# EAGLE design led_lamp (EAGLE 7.7.0)
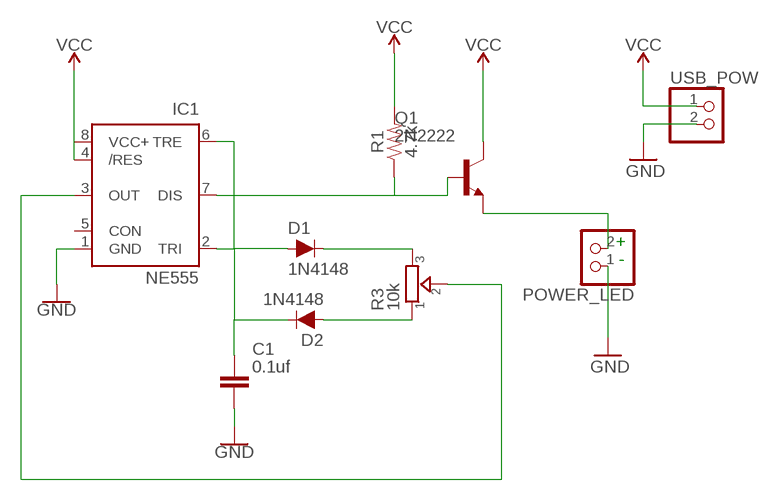
[diagram p0: schematic, sheet 1]

## Parts
C1  0.1uf  CAPACITOR_NPOL-PTH_0.1"  [C0.1PTH]
D1  1N4148  DIODE-1N4148  [DIODE-1N4148]
D2  1N4148  DIODE-1N4148  [DIODE-1N4148]
IC1  NE555  [DIL-08]
POWER_LED  PINHD-1X2  [1X02]
Q1  2N2222  2N2222-NPN-TO92-EBC  [TO92-EBC]
R1  4.7k  10OHM-HORIZ_KIT-1/4W-1%  [AXIAL-0.3-KIT]
R3  10k  TRIMMER-3306F  [TRIMMER_3306F]
USB_POW  PINHD-1X2  [1X02]

## Nets
GND: C1.2 IC1.1(GND) POWER_LED.1 USB_POW.2
N$1: IC1.7(DIS) Q1.B R1.P$1
N$2: C1.1 D1.A D2.C IC1.2(TRI) IC1.6(TRE)
N$3: D1.C R3.3
N$4: D2.A R3.1
N$5: IC1.3(OUT) R3.2
N$7: POWER_LED.2 Q1.E
VCC: IC1.4(/RES) IC1.8(VCC+) Q1.C R1.P$2 USB_POW.1
Unconnected: IC1.5(CON)

## Notes on the sheet
- +
- -

## Library data of the parts
C1 = dp_devices.v6:CAPACITOR_NPOL: Non-Polarized capacitor in various packages
D1 D2 = SparkFun-DiscreteSemi:DIODE: Diode These are standard reverse protection diodes and small signal diodes. SparkFun Products: SparkFun SparkPunk Sound Kit <https://www.sparkfun.com/products/11177> SparkFun ESP8266 Thing <https://www.sparkfun.com/products/13231>; PROD_ID: DIO-08378; VALUE: 200mA/100V/1V
IC1 = st-microelectronics:NE555: General purpose bipolar Timer; MF: Arrow Electronics; MPN: NE555N; OC_FARNELL: 1467742; OC_NEWARK: 89K1486
POWER_LED USB_POW = pinhead:PINHD-1X2: PIN HEADER
Q1 = transistor-neu-to92:*-NPN-: NPN Transistror
R1 = SparkFun-Resistors:10OHM: 10Ω resistor A resistor is a passive two-terminal electrical component that implements electrical resistance as a circuit element. Resistors act to reduce current flow, and, at the same time, act to lower voltage levels within circuits. - Wikipedia; PROD_ID: RES-12180; VALUE: 10
R3 = dp_devices.v6:TRIMMER: Trimmer resistor

## Board
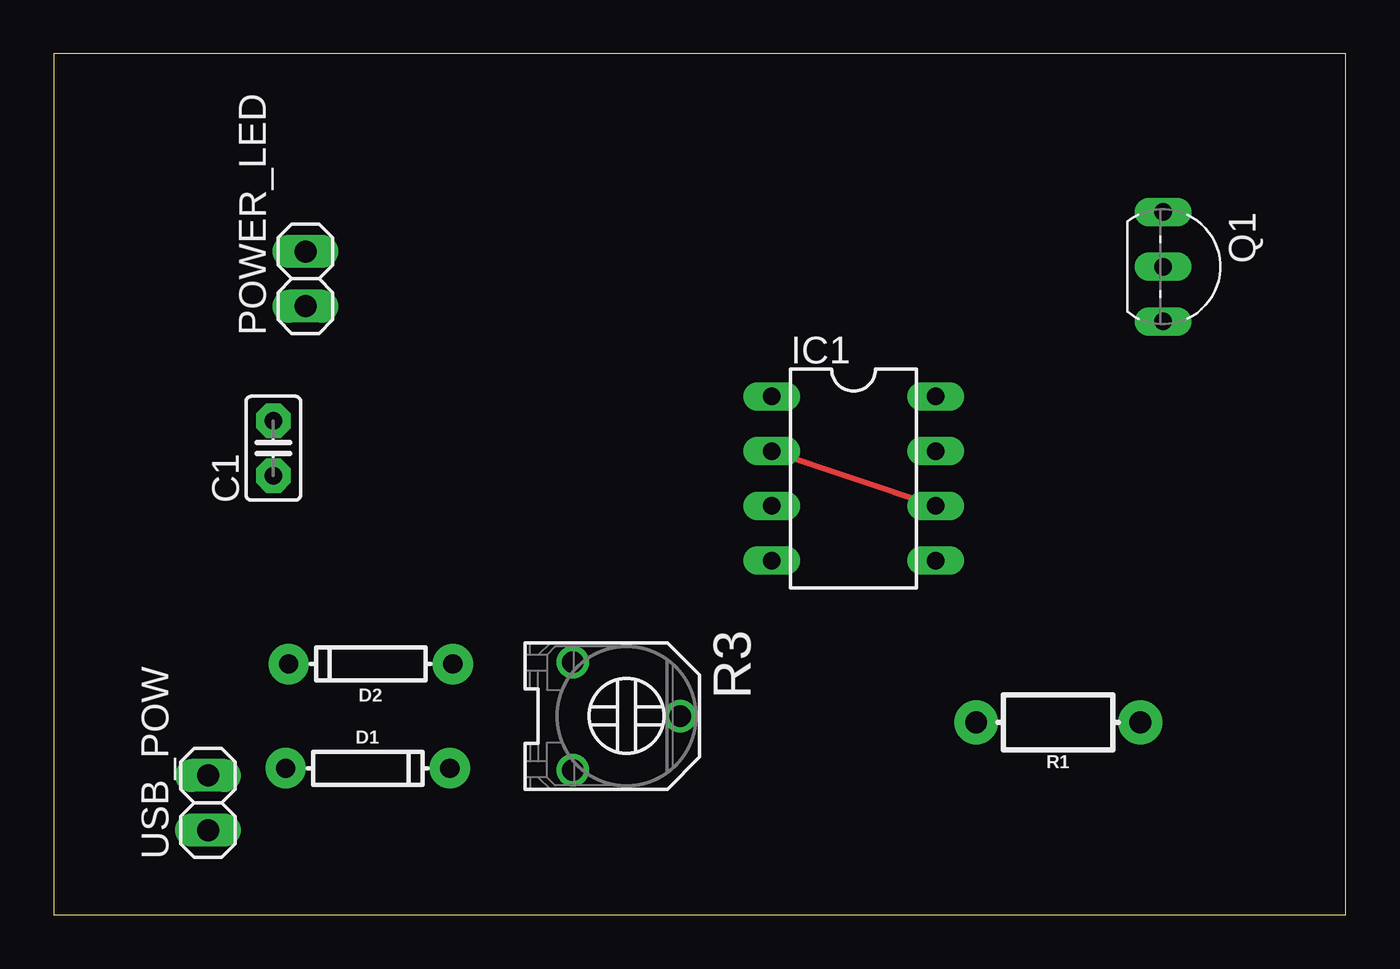
[diagram p1: board, top side]
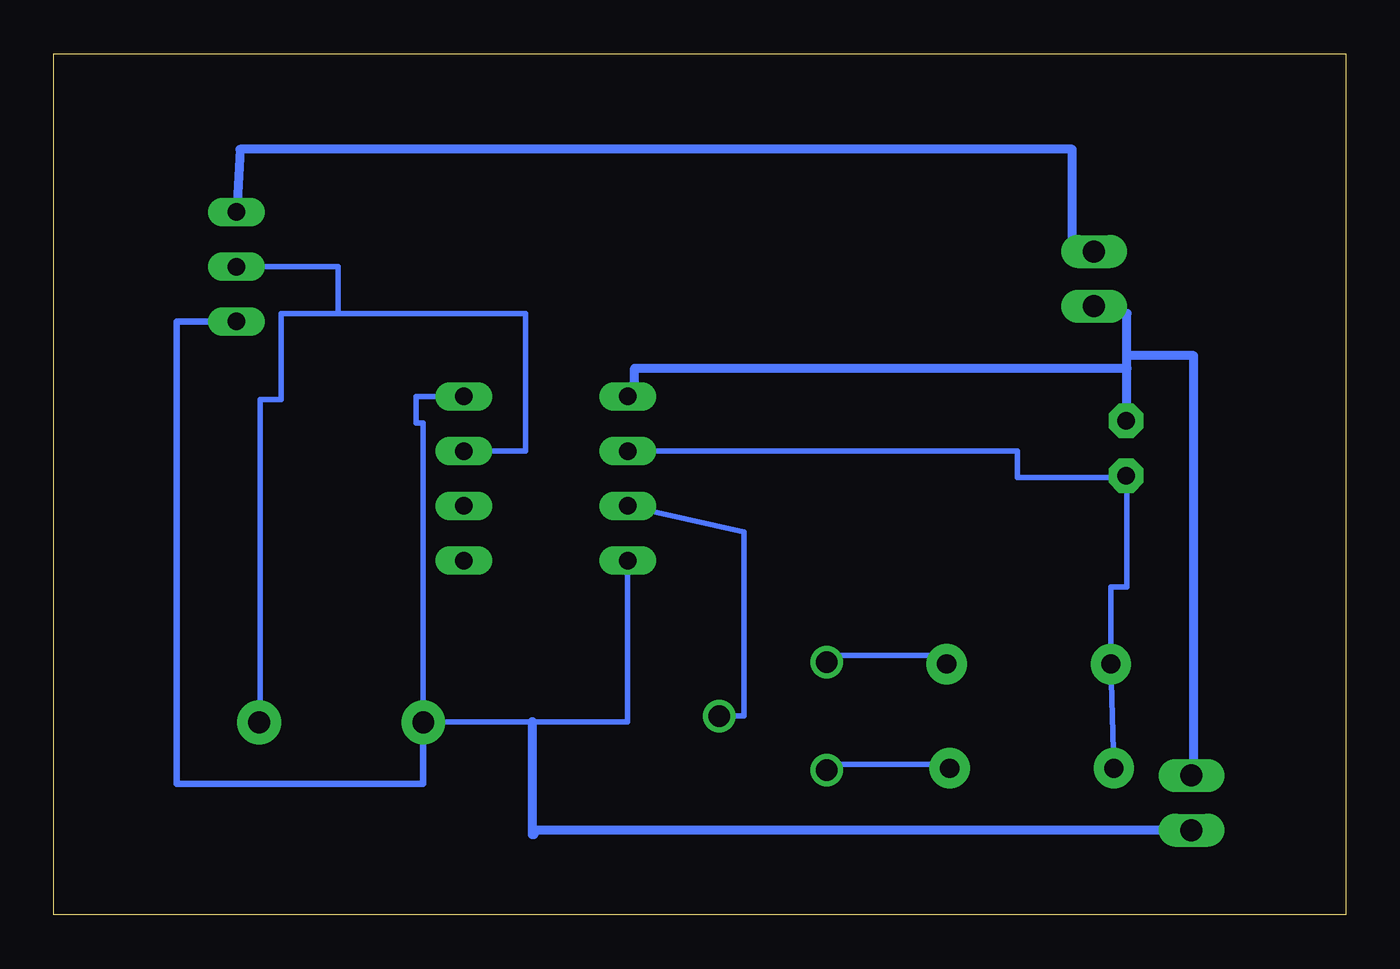
[diagram p2: board, bottom side, seen from below]

Size 60 x 40 mm. Coordinates in mm from the lower left corner, seen from the top.
Outline: 0,0 60,0 60,40 0,40 0,0
Copper layers (1*16): Top 0.035mm / dielectric 1.5mm / Bottom 0.035mm
Design rules "default": minimum track width 10mil, minimum drill 24mil, track to track 8mil, track to pad 8mil, pad to pad 8mil, via to via 8mil, smd to smd 8mil, copper to edge 40mil, drill to drill 8mil, minimum pad ring 10mil, minimum via ring 8mil, stop-mask expansion 4mil, vias tented up to drill 0mil, thermal gap 10mil

### Footprints (pad centres in the part's own frame; a part is rotated, then mirrored left to right if it is on the bottom)
C0.1PTH = drill 0.813 pad 1.6 octagon: 1 -1.27,0; 2 1.27,0
DIODE-1N4148 = drill 0.9 pad 1.88: A -3.81,0; C 3.81,0
DIL-08 = drill 0.813 long: 1 -3.81,-3.81; 2 -1.27,-3.81; 3 1.27,-3.81; 4 3.81,-3.81; 5 3.81,3.81; 6 1.27,3.81; 7 -1.27,3.81; 8 -3.81,3.81
1X02 = drill 1.016 long: 1 -1.27,0; 2 1.27,0
TO92-EBC = drill 0.813 long: B 0,-1.27; C 2.54,-1.27; E -2.54,-1.27
AXIAL-0.3-KIT = drill 1.016 pad 2.032: P$1 -3.81,0; P$2 3.81,0
TRIMMER_3306F = drill 1: 1 -2.5,-2.5; 2 0,2.5; 3 2.5,-2.5

### Placement (x,y rotation side)
C1  10.19,21.68 90 top
D1  14.58,6.81 0 top
D2  14.72,11.66 180 top
IC1  37.14,20.27 270 top
POWER_LED  11.69,29.55 90 top
Q1  52.78,30.11 270 top
R1  46.65,8.94 180 top
R3  26.6,9.24 270 top
USB_POW  7.16,5.21 90 top

### Tracks (layer width: path | path; a pad name or v marks a point on that pad's centre or on a via)
GND
  Bottom 0.254: 10.16,23.5 C1.2
  Bottom 0.406: 10.16,23.16 10.16,23.5 10.16,25.4 | 10.16,25.4 10.16,25.98 | 10.16,25.98 10.16,27.94 11.69,27.94 POWER_LED.1 | IC1.1 33.02,24.08 33.02,25.4 10.16,25.4 | USB_POW.2 7.06,6.48 7.06,25.98 10.16,25.98
N$1
  Bottom 0.254: R1.P$1 50.42,8.95 50.42,23.93 49.45,23.93 49.45,27.94 46.79,27.94 | IC1.7 38.1,21.54 38.1,27.94 46.79,27.94 | Q1.B 46.79,30.11 46.79,27.94
N$2
  Top 0.254: IC1.2 IC1.6
  Bottom 0.254: IC1.2 15.24,21.54 15.24,20.32 10.79,20.32 | 10.79,20.32 10.16,20.32 | 10.16,20.32 9.86,20.32 | 10.16,20.36 10.16,20.32 | 10.16,20.32 10.16,15.24 10.91,15.24 D2.C D1.A | 10.16,20.32 C1.1 10.79,20.32
N$3
  Bottom 0.254: R3.3 23.5,6.99 18.41,6.99 D1.C
N$4
  Bottom 0.254: R3.1 23.5,12.06 19.05,12.06 D2.A
N$5
  Bottom 0.254: R3.2 27.94,9.24 27.94,17.78 IC1.3
N$7
  Bottom 0.406: POWER_LED.2 12.7,30.82 12.7,35.56 51.35,35.56 Q1.E
VCC
  Bottom 0.254: IC1.4 33.36,16.46 33.36,8.97 37.77,8.97 42.84,8.97 R1.P$2 42.84,22.86 43.18,22.86 43.18,24.08 IC1.8
  Bottom 0.305: Q1.C 54.29,27.57 54.29,6.09 42.84,6.09 R1.P$2
  Bottom 0.406: USB_POW.1 37.7,3.94 37.7,3.72 37.77,3.72 37.77,8.97